# Altium schematic sheet Hamamatsu_acond.SchDoc: CSN Detector V3
size A4; Author: RCP; DrawnBy: RCP; Address1: LIM-HGGM; Address3: RCP; DocumentNumber: 1; Revision: 1; SheetNumber: 1; SheetTotal: 3; PageSetup: Record=PageOptions|CenterHorizontal=True|CenterVertical=True|PrintScale=1.00|XCorrection=1.00|YCorrection=1.00|PrintKind=0|BorderSize=5000000|LeftOffset=0|BottomOffset=0|Orientation=2|PaperLength=1000|PaperWidth=1000|Scale=100|PaperSource=7|PrintQuality=-4|MediaType=1|DitherType=10|PaperKind=A4|PrintScaleMode=1
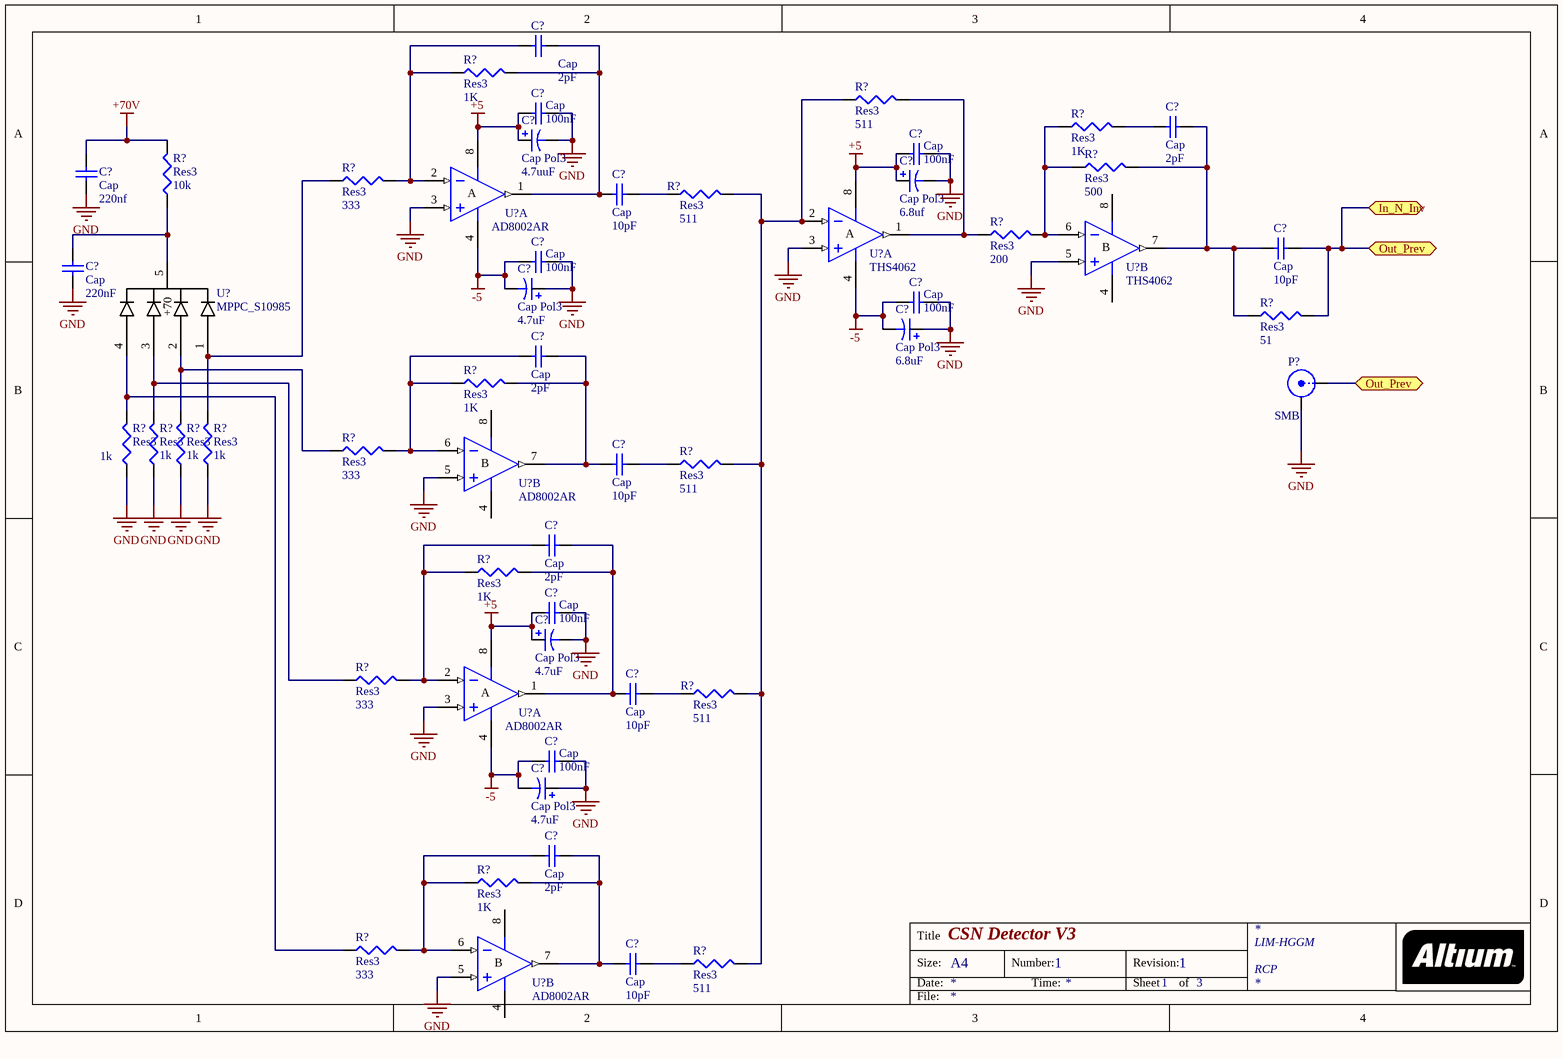
[diagram p0: Hamamatsu_acond.SchDoc]

## Parts
(Parts that share a designator on the sheet are numbered #1, #2 ... from top to bottom, then left to right.)
C?#1  Cap  value 2pF  [C0805]
C?#2  Cap  value 2pF  [C0805]
C?#3  Cap Pol3  value 4.7uuF  [C0805]
C?#4  Cap  value 100nF  [6-0805_N]
C?#5  Cap Pol3  value 6.8uf  [C0805]
C?#6  Cap  value 100nF  [6-0805_N]
C?#7  Cap  value 220nf  [C0805]
C?#8  Cap  value 10pF  [C0805]
C?#9  Cap  value 10pF  [C0805]
C?#10  Cap  value 220nF  [C0805]
C?#11  Cap  value 100nF  [6-0805_N]
C?#12  Cap Pol3  value 4.7uF  [C0805]
C?#13  Cap  value 100nF  [6-0805_N]
C?#14  Cap  value 2pF  [C0805]
C?#15  Cap Pol3  value 6.8uF  [C0805]
C?#16  Cap  value 10pF  [C0805]
C?#17  Cap  value 2pF  [C0805]
C?#18  Cap Pol3  value 4.7uF  [C0805]
C?#19  Cap  value 100nF  [6-0805_N]
C?#20  Cap  value 10pF  [C0805]
C?#21  Cap  value 100nF  [6-0805_N]
C?#22  Cap Pol3  value 4.7uF  [C0805]
C?#23  Cap  value 2pF  [C0805]
C?#24  Cap  value 10pF  [C0805]
P?  SMB  [SMB_V-RJ45]
R?#1  Res3  value 1K  [6-0805_N]
R?#2  Res3  value 511  [6-0805_N]
R?#3  Res3  value 1K  [6-0805_N]
R?#4  Res3  value 500  [6-0805_N]
R?#5  Res3  value 333  [6-0805_N]
R?#6  Res3  value 511  [6-0805_N]
R?#7  Res3  value 10k  [6-0805_N]
R?#8  Res3  value 200  [6-0805_N]
R?#9  Res3  value 51  [6-0805_N]
R?#10  Res3  value 1K  [6-0805_N]
R?#11  Res3  value 333  [6-0805_N]
R?#12  Res3  value 511  [6-0805_N]
R?#13  Res3  value 1k  [6-0805_N]
R?#14  Res3  value 1k  [6-0805_N]
R?#15  Res3  value 1k  [6-0805_N]
R?#16  Res3  value 1k  [6-0805_N]
R?#17  Res3  value 1K  [6-0805_N]
R?#18  Res3  value 333  [6-0805_N]
R?#19  Res3  value 511  [6-0805_N]
R?#20  Res3  value 1K  [6-0805_N]
R?#21  Res3  value 333  [6-0805_N]
R?#22  Res3  value 511  [6-0805_N]
U?#1  AD8002AR  [SO-8_M]  (part A of 2)
U?#2  THS4062  [SO-8_M]  (part A of 2)
U?#3  THS4062  [SO-8_M]  (part B of 2)
U?#4  MPPC_S10985  [S10985_HAM]
U?#5  AD8002AR  [SO-8_M]  (part B of 2)
U?#6  AD8002AR  [SO-8_M]  (part A of 2)
U?#7  AD8002AR  [SO-8_M]  (part B of 2)

## Ports
In_N_Inv, Out_Prev

## Nets
+5: C?#3.1 C?#4.2 C?#5.1 C?#6.2 C?#18.1 C?#19.2 U?#1.8(V+) U?#2.8(V+) U?#6.8(V+)
+70V: C?#7.2 R?#7.2
-5: C?#11.2 C?#12.2 C?#13.2 C?#15.2 C?#21.2 C?#22.2 U?#1.4(V-) U?#2.4(V-) U?#6.4(V-)
GND: C?#3.2 C?#4.1 C?#5.2 C?#6.1 C?#7.1 C?#10.1 C?#11.1 C?#12.1 C?#13.1 C?#15.1 C?#18.2 C?#19.1 C?#21.1 C?#22.1 P?.2(Y) R?#13.1 R?#14.1 R?#15.1 R?#16.1 U?#1.3(IN+) U?#2.3(IN+) U?#3.5(IN+) U?#5.5(IN+) U?#6.3(IN+) U?#7.5(IN+)
In_N_Inv: C?#9.2 P?.1(X) R?#9.2 ; port Out_Prev, port In_N_Inv
NetC?#1_1: C?#1.1 R?#1.1 R?#5.2 U?#1.2(IN-)
NetC?#1_2: C?#1.2 C?#8.1 R?#1.2 U?#1.1(OUT)
NetC?#2_1: C?#2.1 R?#3.2
NetC?#2_2: C?#2.2 C?#9.1 R?#4.2 R?#9.1 U?#3.7(OUT)
NetC?#8_2: C?#8.2 R?#6.1
NetC?#10_2: C?#10.2 R?#7.1 U?#4.5(+70)
NetC?#14_1: C?#14.1 R?#10.1 R?#11.2 U?#5.6(IN-)
NetC?#14_2: C?#14.2 C?#16.1 R?#10.2 U?#5.7(OUT)
NetC?#16_2: C?#16.2 R?#12.1
NetC?#17_1: C?#17.1 R?#17.1 R?#18.2 U?#6.2(IN-)
NetC?#17_2: C?#17.2 C?#20.1 R?#17.2 U?#6.1(OUT)
NetC?#20_2: C?#20.2 R?#19.1
NetC?#23_1: C?#23.1 R?#20.1 R?#21.2 U?#7.6(IN-)
NetC?#23_2: C?#23.2 C?#24.1 R?#20.2 U?#7.7(OUT)
NetC?#24_2: C?#24.2 R?#22.1
NetR?#2_1: R?#2.1 R?#6.2 R?#12.2 R?#19.2 R?#22.2 U?#2.2(IN-)
NetR?#2_2: R?#2.2 R?#8.1 U?#2.1(OUT)
NetR?#3_1: R?#3.1 R?#4.1 R?#8.2 U?#3.6(IN-)
NetR?#5_1: R?#5.1 R?#16.2 U?#4.1(Pin1)
NetR?#11_1: R?#11.1 R?#15.2 U?#4.2(Pin2)
NetR?#13_2: R?#13.2 R?#21.1 U?#4.4
NetR?#14_2: R?#14.2 R?#18.1 U?#4.3

Not connected (* = marked no-connect by the designer): U?#3 4(V-) 8(V+); U?#5 4(V-) 8(V+); U?#7 4(V-) 8(V+)

## Notes on the sheet
- Title
- Size:
- Date:
- A4
- Number:
- Time:
- Revision:
- Sheet
- of
- File:
- (in symbol AD8002AR, part A) A
- (in symbol AD8002AR, part B) B

## Library data of the parts
C?#1 C?#2 C?#4 C?#6-C?#11 C?#13 C?#14 C?#16 C?#17 C?#19-C?#21 C?#23 C?#24 = Cap: Capacitor; Published: 8-Jun-2000; LatestRevisionDate: 17-Jul-2002; LatestRevisionNote: Re-released for DXP Platform.; PackageReference: RAD-0.3; Publisher: Altium Limited; PackageDescription: Radial Cap, Thru-Hole; 2 Leads; 0.3 in Pin Spacing
C?#3 C?#5 C?#12 C?#15 C?#18 C?#22 = Cap Pol3: Polarized Capacitor (Surface Mount); Published: 8-Jun-2000; LatestRevisionDate: 29-May-2009; LatestRevisionNote: IPC-7351 Footprint Added.; PackageReference: C0805; Publisher: Altium Limited; PackageDescription: Chip Capacitor
P? = SMB: SMB Straight Connector; LatestRevisionDate: 17-Jul-2002; LatestRevisionNote: Re-released for DXP Platform.; Publisher: Altium Limited
R?#1-R?#22 = Res3: Resistor; Published: 8-Jun-2000; LatestRevisionDate: 29-May-2009; LatestRevisionNote: IPC-7351 Footprint Added.; PackageReference: J1-0603; Publisher: Altium Limited; PackageDescription: Chip Resistor
U?#1-U?#3 U?#5-U?#7 = AD8002AR: Dual 600MHz, 50mW Current Feedback Amplifier; Published: 8-Jun-2000; LatestRevisionDate: 13-Apr-2006; LatestRevisionNote: IPC-7351 Footprint Added.; DatasheetVersion: REV. C 1999; PackageVersion: revA; PackageReference: SO-8; Publisher: Altium Limited; PackageDescription: 8-Pin Small Outline Integrated Circuit 1.27 mm Pitch; Code_JEDEC: MS-012-AA; Code_IPC: SOIC127P600-8; ComponentLink1Description: Manufacturer Link; ComponentLink1URL: http://www.analog.com/en/prod/0,,759_786_AD8002%2C00.html; ComponentLink2Description: Datasheet; ComponentLink2URL: http://www.analog.com/UploadedFiles/Data_Sheets/147523773AD8002_d.pdf